# EAGLE design Suport 0.1 (EAGLE 9.6.2)
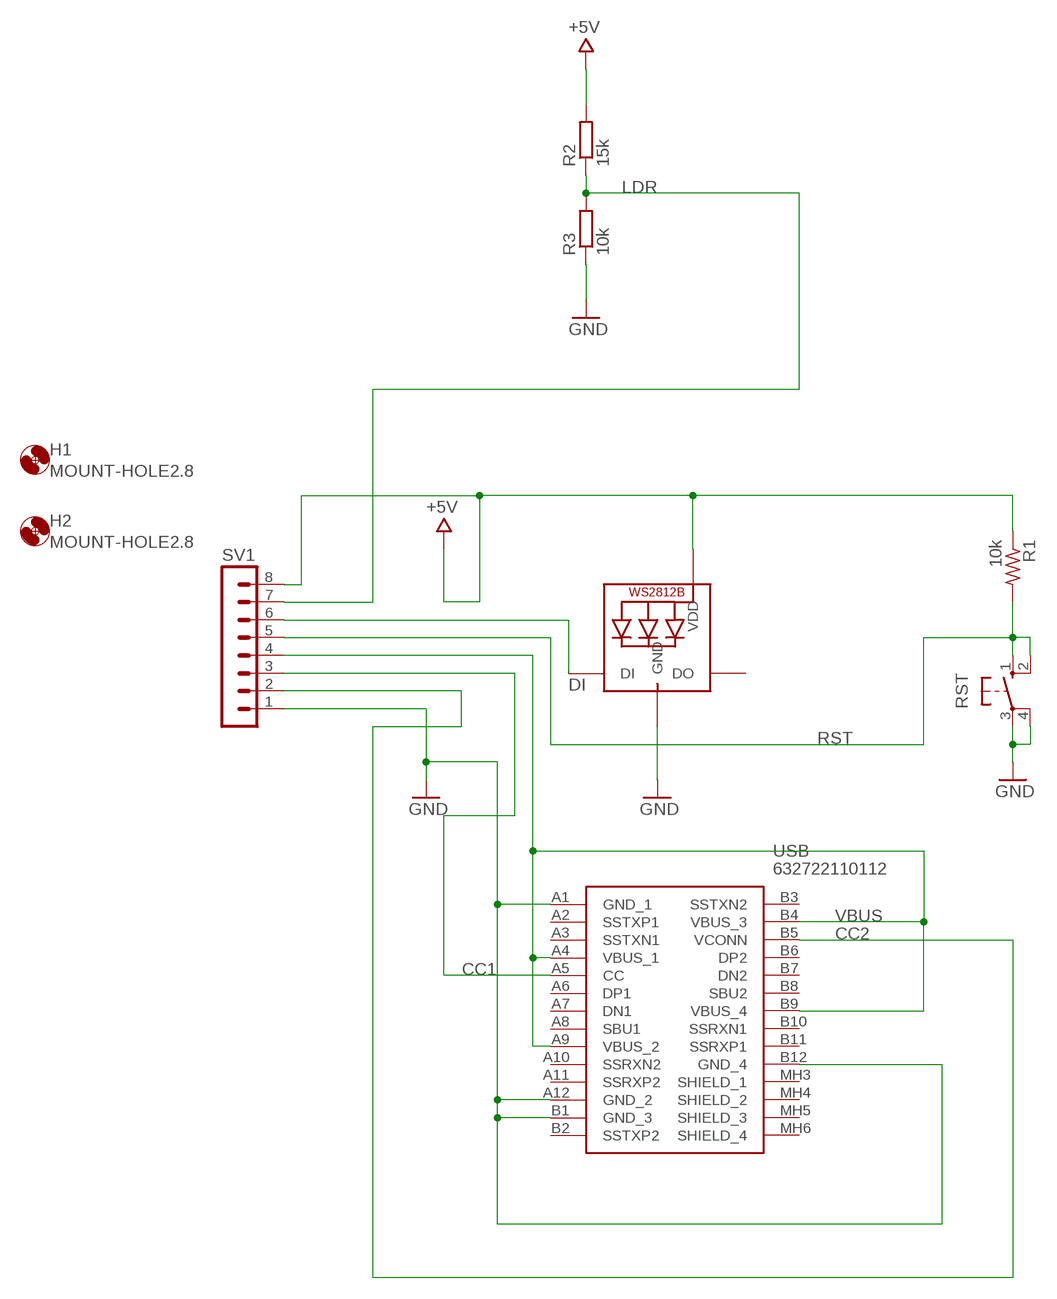
[diagram p0: schematic, sheet 1]

## Parts
H1  MOUNT-HOLE2.8  [2,8]
H2  MOUNT-HOLE2.8  [2,8]
LED1  WS2812B3535  [LED3535]
R1  10k  R-US_M2012  [M2012]
R2  15k  R-EU_0204/2V  [0204V]
R3  10k  R-EU_M2012  [M2012]
RST  10-XX  [B3F-10XX]
SV1  MA08-1  [MA08-1]
USB  632722110112  [632722110112]

## Nets
+5V [pwr]: LED1.2(VDD) R1.1 R2.2 SV1.8
CC1: SV1.3 USB.A5(CC)
CC2: SV1.2 USB.B5(VCONN)
DI: LED1.1(DI) SV1.6
GND: LED1.4(GND) R3.1 RST.3(P) RST.4(P1) SV1.1 USB.A1(GND_1) USB.A12(GND_2) USB.B1(GND_3) USB.B12(GND_4)
LDR: R2.1 R3.2 SV1.7
RST: R1.2 RST.1(S) RST.2(S1) SV1.5
VBUS: SV1.4 USB.A4(VBUS_1) USB.A9(VBUS_2) USB.B4(VBUS_3) USB.B9(VBUS_4)
Unconnected: LED1.3(DO) USB.A2(SSTXP1) USB.A3(SSTXN1) USB.A6(DP1) USB.A7(DN1) USB.A8(SBU1) USB.A10(SSRXN2) USB.A11(SSRXP2) USB.B2(SSTXP2) USB.B3(SSTXN2) USB.B6(DP2) USB.B7(DN2) USB.B8(SBU2) USB.B10(SSRXN1) USB.B11(SSRXP1) USB.MH3(SHIELD_1) USB.MH4(SHIELD_2) USB.MH5(SHIELD_3) USB.MH6(SHIELD_4)

## Library data of the parts
H1 H2 = holes:MOUNT-HOLE: MOUNTING HOLE with drill center marker
LED1 = adafruit:WS2812B
R1 = adafruit:R-US_: RESISTOR, American symbol
R2 R3 = resistor:R-EU_: RESISTOR, European symbol
RST = switch-omron:10-XX: OMRON SWITCH; MPN: B3F-1000; OC_FARNELL: 176432; OC_NEWARK: 36M3542
SV1 = con-lstb:MA08-1: PIN HEADER; OC_FARNELL: unknown; OC_NEWARK: unknown
USB = SamacSys_Parts:632722110112: USB Connectors WR-COM SMT Vertical Black Source: Datasheet; DESCRIPTION: USB Connectors WR-COM SMT Vertical Black; HEIGHT: 7.4mm; MANUFACTURER_NAME: Wurth Elektronik; MANUFACTURER_PART_NUMBER: 632722110112; MOUSER_PART_NUMBER: 710-632722110112; MOUSER_PRICE-STOCK: https://www.mouser.co.uk/ProductDetail/Wurth-Elektronik/632722110112?qs=2WXlatMagcH6zbfYjgLonA%3D%3D

## Module TUBEIN16
Ports: 

### Library data of the parts

## Net classes
0 default: width 0.254 mm, clearance 0.254 mm
1 pwr: width 0.254 mm, clearance 0.205 mm to class 0, clearance 0.356 mm

## Board
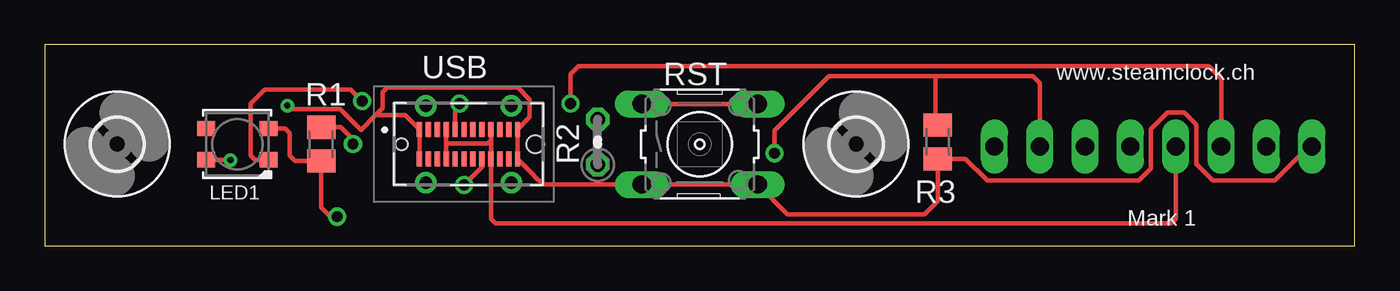
[diagram p1: board, top side]
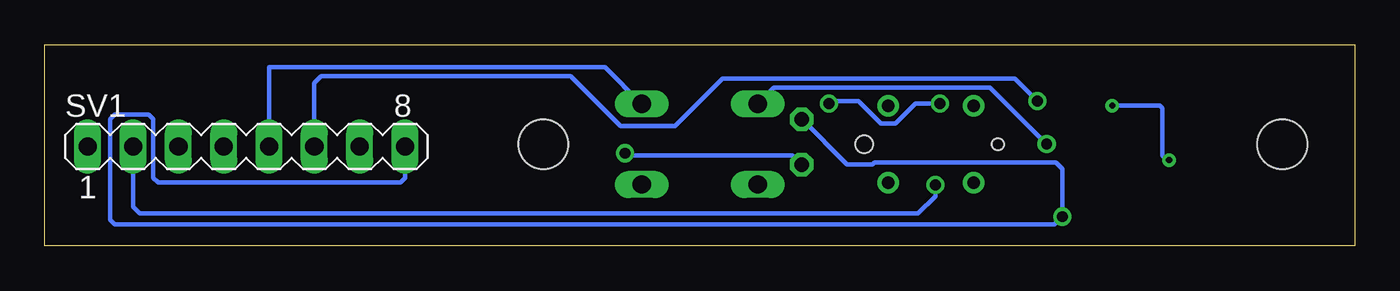
[diagram p2: board, bottom side, seen from below]

Size 73.41 x 11.3 mm. Coordinates in mm from the lower left corner, seen from the top.
Outline: 0,11.3 0,0 73.41,0 73.41,11.3 0,11.3
Copper layers (1*16): Top 0.035mm / dielectric 1.5mm / Bottom 0.035mm
Design rules "default *": minimum track width 6mil, minimum drill 0.35mm, track to track 4mil, track to pad 6mil, pad to pad 6mil, via to via 6mil, smd to smd 6mil, copper to edge 40mil, drill to drill 6mil, minimum pad ring 10mil, minimum via ring 8mil, stop-mask expansion 4mil, vias tented up to drill 0mil, thermal gap 10mil

### Footprints (pad centres in the part's own frame; a part is rotated, then mirrored left to right if it is on the bottom)
2,8 = hole 2.8: 0,0
LED3535 = smd 1 x 0.85: 1 -1.75,0.875; 2 -1.75,-0.875; 3 1.75,-0.875; 4 1.75,0.875
M2012 = smd 1.3 x 1.6: 1 -0.95,0; 2 0.95,0
0204V = drill 0.813 octagon: 1 -1.27,0; 2 1.27,0
B3F-10XX = drill 1.016 long: 1 -3.251,2.261; 2 3.251,2.261; 3 -3.251,-2.261; 4 3.251,-2.261
MA08-1 = drill 1.016 long: 1 -8.89,0; 2 -6.35,0; 3 -3.81,0; 4 -1.27,0; 5 1.27,0; 6 3.81,0; 7 6.35,0; 8 8.89,0
632722110112 = smd 0.3 x 0.85: A1 -2.75,0.83; A2 -2.25,0.83; A3 -1.75,0.83; A4 -1.25,0.83; A5 -0.75,0.83; A6 -0.25,0.83; A7 0.25,0.83; A8 0.75,0.83; A9 1.25,0.83; A10 1.75,0.83; A11 2.25,0.83; A12 2.75,0.83; B1 2.75,-0.83; B2 2.25,-0.83; B3 1.75,-0.83; B4 1.25,-0.83; B5 0.75,-0.83; B6 0.25,-0.83; B7 -0.25,-0.83; B8 -0.75,-0.83; B9 -1.25,-0.83; B10 -1.75,-0.83; B11 -2.25,-0.83; B12 -2.75,-0.83 | drill 0.7 pad 1.2: MH3 -2.4,2.15; MH4 2.4,2.15; MH5 -2.4,-2.15; MH6 2.4,-2.15 | hole 0.66: -3.75,0 | hole 1: 3.75,0

### Placement (x,y rotation side)
H1  4.06,5.71 0 top
H2  45.47,5.71 0 top
LED1  10.8,5.71 180 top
R1  15.49,5.71 90 top
R2  30.99,5.84 90 top
R3  50.04,5.84 90 top
RST  36.7,5.71 0 top
SV1  62.1,5.59 0 bottom
USB  23.75,5.71 0 top

### Tracks (layer width: path | path; a pad name or v marks a point on that pad's centre or on a via)
+5V  (via drill 0.61)
  Top 0.254: v16.38,1.65 16,1.65 15.49,2.16 R1.1 14.03,4.76 13.72,5.08 13.72,6.35 13.48,6.59 LED1.2
  Bottom 0.254: R2.2 28.46,4.58 27.03,4.58 26.91,4.7 16.76,4.7 16.38,4.32 v16.38,1.65 16.41,1.65 16.85,1.21 69.47,1.21 69.72,1.47 69.72,7.11 69.47,7.37 67.56,7.37 67.31,7.11 67.31,3.81 67.06,3.56 53.47,3.56 53.21,3.81 SV1.8
CC1  (via drill 0.61)
  Top 0.254: USB.A5 23,7.89 23.11,8 v23.24,8 | v29.46,8 29.46,9.65 29.91,10.1 65.21,10.1 65.91,9.4 SV1.3
  Bottom 0.254: v23.24,8 24.63,8 25.74,6.88 26.55,6.88 27.8,8.13 29.34,8.13 v29.46,8
CC2  (via drill 0.61)
  Top 0.254: USB.B5 24.5,4.43 v23.5,3.43
  Bottom 0.254: v23.5,3.43 23.5,2.79 24.47,1.82 63.29,1.82 68.07,1.82 68.45,2.2 SV1.2
DI  (via drill 0.61)
  Top 0.254: LED1.1 11.8,4.84 11.56,5.08 11.56,8 12.32,8.76 17.15,8.76 v17.78,8.13
  Bottom 0.254: v17.78,8.13 19.05,9.4 35.43,9.4 38.1,6.73 41.15,6.73 43.94,9.52 57.91,9.52 58.29,9.14 SV1.6
GND  (via drill 0.35)
  Top 0.254: USB.B1 26.5,4.6 | USB.A12 26.5,6.83 | USB.A12 USB.B1 | 21,4.74 USB.B12 USB.A1 20.19,7.35 18.55,7.35 | USB.A12 27.18,7.22 27.18,8.23 26.52,8.89 19.18,8.89 18.94,8.65 18.94,7.73 18.55,7.35 | USB.B1 27.43,3.95 27.43,3.94 27.92,3.45 RST.3 RST.4 41.63,1.78 49.28,1.78 50.04,2.54 R3.1 51.6,4.89 52.81,3.68 61.31,3.68 61.98,4.35 61.98,6.57 62.9,7.49 63.85,7.49 64.52,6.82 64.52,4.61 65.44,3.68 68.93,3.68 70.83,5.59 SV1.1 | LED1.4 9.14,4.74 9.23,4.83 v10.41,4.83 | 18.55,7.35 17.72,6.52 16.55,7.7 13.77,7.7 v13.59,7.87
  Bottom 0.254: v13.59,7.87 10.92,7.87 10.8,7.75 10.8,5.08 10.54,4.83 v10.41,4.83
LDR  (via drill 0.61)
  Top 0.254: v40.89,5.21 40.89,6.48 43.94,9.52 49.91,9.52 | 49.91,9.52 55.37,9.52 55.75,9.14 SV1.7 | R3.2 49.91,6.92 49.91,9.52
  Bottom 0.254: R2.1 31.5,5.08 40.89,5.08 v40.89,5.21
RST  (via drill 0.61)
  Top 0.254: R1.2 16.58,6.66 17.27,5.97 v17.27,5.71 | RST.1 RST.2
  Bottom 0.254: v17.27,5.71 20.45,8.89 32.54,8.89 RST.1 | RST.2 42.01,10.03 60.83,10.03 SV1.5
VBUS
  Top 0.254: USB.A4 22.5,5.71 | 22.5,5.71 USB.B9 | USB.A9 25,5.84 | 25,5.84 USB.B4 25.02,4.86 25.02,1.52 25.27,1.27 63.12,1.27 63.37,1.52 SV1.4 | 25,5.84 24.91,5.84 24.81,5.74 22.52,5.74 22.5,5.71

### Text on the board
tNames: www.steamclock.ch | Mark 1